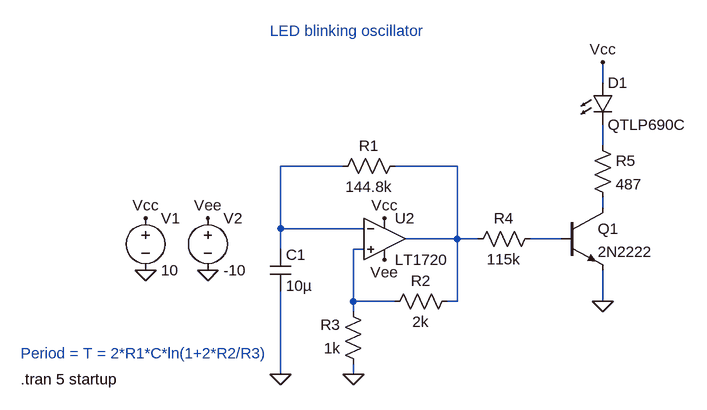
[diagram p0: schematic LED-blinking-oscillator.asc]
LED-blinking-oscillator.asc, the LTspice schematic file:
Version 4
SHEET 1 880 680
WIRE 464 -112 464 -144
WIRE 464 -16 464 -48
WIRE 64 16 -32 16
WIRE 240 16 144 16
WIRE 464 80 464 64
WIRE -32 112 -32 16
WIRE 96 112 -32 112
WIRE 240 128 240 16
WIRE 240 128 160 128
WIRE 272 128 240 128
WIRE 400 128 352 128
WIRE -32 144 -32 112
WIRE 96 144 80 144
WIRE 80 224 80 144
WIRE 144 224 80 224
WIRE 240 224 240 128
WIRE 240 224 224 224
WIRE 464 224 464 176
WIRE 80 240 80 224
WIRE -32 336 -32 208
WIRE 80 336 80 320
FLAG 80 336 0
FLAG -32 336 0
FLAG -240 176 0
FLAG -240 96 Vcc
FLAG 128 96 Vcc
FLAG 464 -144 Vcc
FLAG 464 224 0
FLAG -144 176 0
FLAG 128 160 Vee
FLAG -144 96 Vee
SYMBOL cap -48 144 R0
SYMATTR InstName C1
SYMATTR Value 10µ
SYMBOL res 160 0 R90
WINDOW 0 0 56 VBottom 2
WINDOW 3 32 56 VTop 2
SYMATTR InstName R1
SYMATTR Value 144.8k
SYMBOL res 240 208 R90
WINDOW 0 0 56 VBottom 2
WINDOW 3 32 56 VTop 2
SYMATTR InstName R2
SYMATTR Value 2k
SYMBOL res 96 336 R180
WINDOW 0 36 76 Left 2
WINDOW 3 36 40 Left 2
SYMATTR InstName R3
SYMATTR Value 1k
SYMBOL voltage -240 80 R0
WINDOW 123 0 0 Left 2
WINDOW 39 0 0 Left 2
SYMATTR InstName V1
SYMATTR Value 10
SYMBOL res 368 112 R90
WINDOW 0 0 56 VBottom 2
WINDOW 3 32 56 VTop 2
SYMATTR InstName R4
SYMATTR Value 115k
SYMBOL npn 400 80 R0
SYMATTR InstName Q1
SYMATTR Value 2N2222
SYMBOL res 448 -32 R0
SYMATTR InstName R5
SYMATTR Value 487
SYMBOL LED 448 -112 R0
SYMATTR InstName D1
SYMATTR Value QTLP690C
SYMBOL voltage -144 80 R0
WINDOW 123 0 0 Left 2
WINDOW 39 0 0 Left 2
SYMATTR InstName V2
SYMATTR Value -10
SYMBOL Comparators\\LT1720 128 64 R0
SYMATTR InstName U2
TEXT -432 344 Left 2 !.tran 5 startup
TEXT -432 304 Left 2 ;Period = T = 2*R1*C*ln(1+2*R2/R3)
TEXT -48 -192 Left 2 ;LED blinking oscillator

The netlist it stands for:
* LED-blinking-oscillator.asc
C1 N002 0 10µ
R1 N003 N002 144.8k
R2 N003 N006 2k
R3 0 N006 1k
V1 Vcc 0 10
R4 N005 N003 115k
Q1 N004 N005 0 0 2N2222
R5 N001 N004 487
D1 Vcc N001 QTLP690C
V2 Vee 0 -10
XU2 N006 N002 Vcc Vee N003 LT1720  ; pins In+ In- V+ V- OUT
.model D D
.lib standard.dio
.model NPN NPN
.model PNP PNP
.lib standard.bjt
.tran 5 startup
* Period = T = 2*R1*C*ln(1+2*R2/R3)
* LED blinking oscillator
.lib LT1720.sub
.backanno
.end